# EAGLE design dual_brushed_rc (EAGLE 6.6.0)

## Sheet 1 of 8
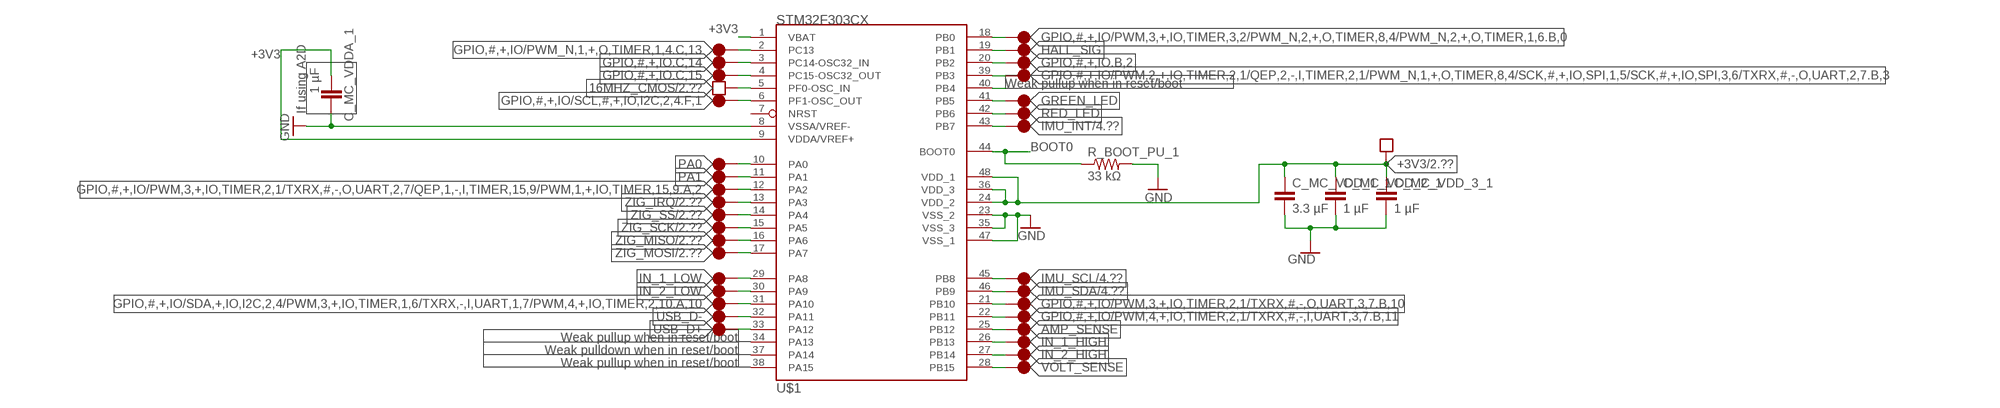
[diagram p0: schematic, sheet 1]

### Parts
C_MC_VDD_1_1  3.3 µF  C-EUC0603  [C0603]
C_MC_VDD_2_1  1 µF  C-EUC0402  [C0402]
C_MC_VDD_3_1  1 µF  C-EUC0402  [C0402]
C_MC_VDDA_1  1 µF  C-EUC0402  [C0402]
R_BOOT_PU_1  33 kΩ  R-US_R0402  [R0402]
U$1  STM32F303CX  [LQFP48]

### Nets
16MHZ_CMOS: U$1.5(PF0-OSC_IN) ; supply symbol labelled BLOCK_REQUIREMENT ; also sheet 2,3
+3V3: C_MC_VDD_1_1.1 C_MC_VDD_2_1.1 C_MC_VDD_3_1.1 C_MC_VDDA_1.1 U$1.1(VBAT) U$1.9(VDDA/VREF+) U$1.24(VDD_2) U$1.36(VDD_3) U$1.48(VDD_1) ; supply symbol labelled BLOCK_REQUIREMENT ; also sheet 2,3,4,5,6
AMP_SENSE: U$1.25(PB12) ; supply symbol labelled BLOCK_CONNECTOR ; also sheet 5
BLUE_LED: U$1.40(PB4) ; also sheet 8
BOOT0: R_BOOT_PU_1.1 U$1.44(BOOT0) ; also sheet 7
GND: C_MC_VDD_1_1.2 C_MC_VDD_2_1.2 C_MC_VDD_3_1.2 C_MC_VDDA_1.2 R_BOOT_PU_1.2 U$1.8(VSSA/VREF-) U$1.23(VSS_2) U$1.35(VSS_3) U$1.47(VSS_1) ; also sheet 2,3,4,5,6,7,8
GPIO,#,+,IO.B,2: U$1.20(PB2) ; supply symbol labelled BLOCK_CONNECTOR
GPIO,#,+,IO.C,14: U$1.3(PC14-OSC32_IN) ; supply symbol labelled BLOCK_CONNECTOR
GPIO,#,+,IO.C,15: U$1.4(PC15-OSC32_OUT) ; supply symbol labelled BLOCK_CONNECTOR
GPIO,#,+,IO/PWM,2,+,IO,TIMER,2,1/QEP,2,-,I,TIMER,2,1/PWM_N,1,+,O,TIMER,8,4/SCK,#,+,IO,SPI,1,5/SCK,#,+,IO,SPI,3,6/TXRX,#,-,O,UART,2,7.B,3: U$1.39(PB3) ; supply symbol labelled BLOCK_CONNECTOR
GPIO,#,+,IO/PWM,3,+,IO,TIMER,2,1/TXRX,#,-,O,UART,2,7/QEP,1,-,I,TIMER,15,9/PWM,1,+,IO,TIMER,15,9.A,2: U$1.12(PA2) ; supply symbol labelled BLOCK_CONNECTOR
GPIO,#,+,IO/PWM,3,+,IO,TIMER,2,1/TXRX,#,-,O,UART,3,7.B,10: U$1.21(PB10) ; supply symbol labelled BLOCK_CONNECTOR
GPIO,#,+,IO/PWM,3,+,IO,TIMER,3,2/PWM_N,2,+,O,TIMER,8,4/PWM_N,2,+,O,TIMER,1,6.B,0: U$1.18(PB0) ; supply symbol labelled BLOCK_CONNECTOR
GPIO,#,+,IO/PWM,4,+,IO,TIMER,2,1/TXRX,#,-,I,UART,3,7.B,11: U$1.22(PB11) ; supply symbol labelled BLOCK_CONNECTOR
GPIO,#,+,IO/PWM_N,1,+,O,TIMER,1,4.C,13: U$1.2(PC13) ; supply symbol labelled BLOCK_CONNECTOR
GPIO,#,+,IO/SCL,#,+,IO,I2C,2,4.F,1: U$1.6(PF1-OSC_OUT) ; supply symbol labelled BLOCK_CONNECTOR
GPIO,#,+,IO/SDA,+,IO,I2C,2,4/PWM,3,+,IO,TIMER,1,6/TXRX,-,I,UART,1,7/PWM,4,+,IO,TIMER,2,10.A,10: U$1.31(PA10) ; supply symbol labelled BLOCK_CONNECTOR
GREEN_LED: U$1.41(PB5) ; supply symbol labelled BLOCK_CONNECTOR ; also sheet 8
HALL_SIG: U$1.19(PB1) ; supply symbol labelled BLOCK_CONNECTOR ; also sheet 6
IMU_INT: U$1.43(PB7) ; supply symbol labelled BLOCK_CONNECTOR ; also sheet 4
IMU_SCL: U$1.45(PB8) ; supply symbol labelled BLOCK_CONNECTOR ; also sheet 4
IMU_SDA: U$1.46(PB9) ; supply symbol labelled BLOCK_CONNECTOR ; also sheet 4
IN_1_HIGH: U$1.26(PB13) ; supply symbol labelled BLOCK_CONNECTOR ; also sheet 5
IN_1_LOW: U$1.29(PA8) ; supply symbol labelled BLOCK_CONNECTOR ; also sheet 5
IN_2_HIGH: U$1.27(PB14) ; supply symbol labelled BLOCK_CONNECTOR ; also sheet 5
IN_2_LOW: U$1.30(PA9) ; supply symbol labelled BLOCK_CONNECTOR ; also sheet 5
PA0: U$1.10(PA0) ; supply symbol labelled BLOCK_CONNECTOR
PA1: U$1.11(PA1) ; supply symbol labelled BLOCK_CONNECTOR
RED_LED: U$1.42(PB6) ; supply symbol labelled BLOCK_CONNECTOR ; also sheet 8
USB_D+: U$1.33(PA12) ; supply symbol labelled BLOCK_CONNECTOR ; also sheet 7
USB_D-: U$1.32(PA11) ; supply symbol labelled BLOCK_CONNECTOR ; also sheet 7
VOLT_SENSE: U$1.28(PB15) ; supply symbol labelled BLOCK_CONNECTOR ; also sheet 6
ZIG_IRQ: U$1.13(PA3) ; supply symbol labelled BLOCK_CONNECTOR ; also sheet 2
ZIG_MISO: U$1.16(PA6) ; supply symbol labelled BLOCK_CONNECTOR ; also sheet 2
ZIG_MOSI: U$1.17(PA7) ; supply symbol labelled BLOCK_CONNECTOR ; also sheet 2
ZIG_SCK: U$1.15(PA5) ; supply symbol labelled BLOCK_CONNECTOR ; also sheet 2
ZIG_SS: U$1.14(PA4) ; supply symbol labelled BLOCK_CONNECTOR ; also sheet 2
Unconnected: U$1.7(NRST) U$1.34(PA13) U$1.37(PA14) U$1.38(PA15)

### Notes on the sheet
- Weak pullup when in reset/boot
- If using A2D
- Weak pullup when in reset/boot
- Weak pulldown when in reset/boot
- Weak pullup when in reset/boot

## Sheet 2 of 8
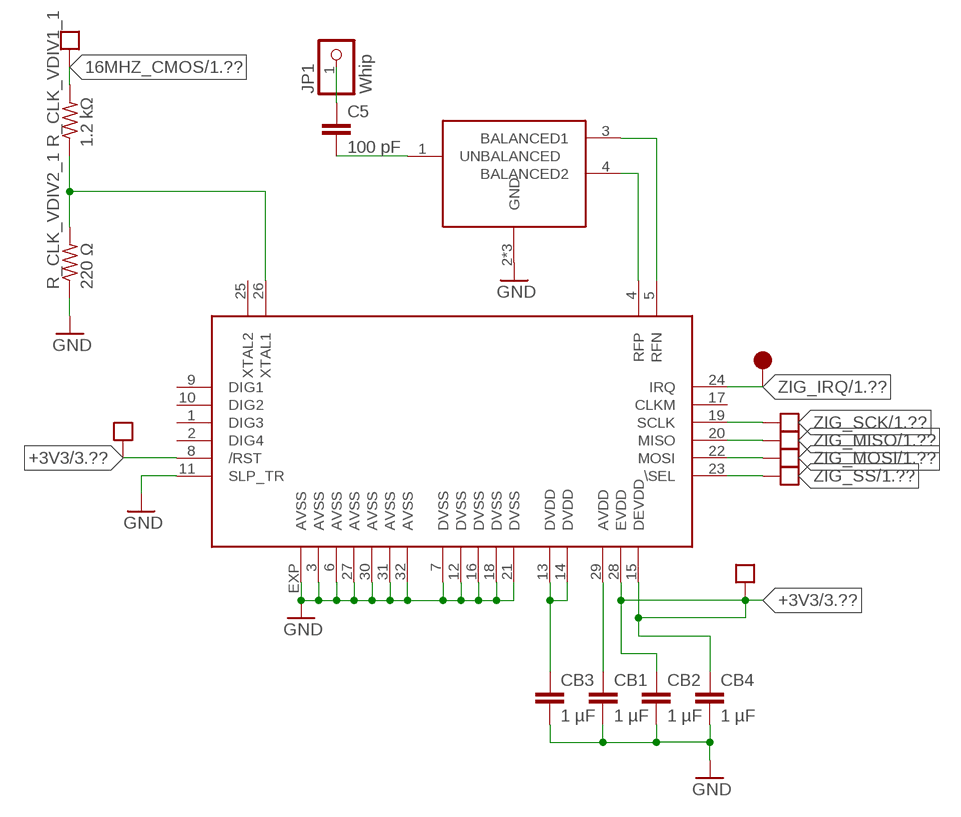
[diagram p1: schematic, sheet 2]

### Parts
BALUN1  0896FB15A0100  [0896FB15A0100]
C5  100 pF  C-EUC0402  [C0402]
CB1  1 µF  C-EUC0402  [C0402]
CB2  1 µF  C-EUC0402  [C0402]
CB3  1 µF  C-EUC0402  [C0402]
CB4  1 µF  C-EUC0402  [C0402]
JP1  Whip  PINHD-1X01_2.54-S  [1X01-S]
R_CLK_VDIV1_1  1.2 kΩ  R-US_R0402  [R0402]
R_CLK_VDIV2_1  220 Ω  R-US_R0402  [R0402]
U$51  AT86RF  [QFNN32]

### Nets
16MHZ_0V5_1: R_CLK_VDIV1_1.1 R_CLK_VDIV2_1.2 U$51.26(XTAL1)
16MHZ_CMOS: R_CLK_VDIV1_1.2 ; supply symbol labelled BLOCK_REQUIREMENT ; also sheet 1,3
+3V3: CB2.1 CB4.1 U$51.8(/RST) U$51.15(DEVDD) U$51.28(EVDD) ; supply symbol labelled BLOCK_REQUIREMENT ; also sheet 1,3,4,5,6
GND: BALUN1.2(GND) BALUN1.5(GND) BALUN1.6(GND) CB1.2 CB2.2 CB3.2 CB4.2 R_CLK_VDIV2_1.1 U$51.3(AVSS) U$51.6(AVSS) U$51.7(DVSS) U$51.11(SLP_TR) U$51.12(DVSS) U$51.16(DVSS) U$51.18(DVSS) U$51.21(DVSS) U$51.27(AVSS) U$51.30(AVSS) U$51.31(AVSS) U$51.32(AVSS) U$51.EXP(AVSS) ; also sheet 1,3,4,5,6,7,8
N$2: BALUN1.1(UNBALANCED) C5.2
N$3: C5.1 JP1.1
N$4: CB3.1 U$51.13(DVDD) U$51.14(DVDD)
N$6: CB1.1 U$51.29(AVDD)
N$8: BALUN1.4(BALANCED2) U$51.4(RFP)
N$9: BALUN1.3(BALANCED1) U$51.5(RFN)
ZIG_IRQ: U$51.24(IRQ) ; supply symbol labelled BLOCK_CONNECTOR ; also sheet 1
ZIG_MISO: U$51.20(MISO) ; supply symbol labelled BLOCK_REQUIREMENT ; also sheet 1
ZIG_MOSI: U$51.22(MOSI) ; supply symbol labelled BLOCK_REQUIREMENT ; also sheet 1
ZIG_SCK: U$51.19(SCLK) ; supply symbol labelled BLOCK_REQUIREMENT ; also sheet 1
ZIG_SS: U$51.23(\SEL) ; supply symbol labelled BLOCK_REQUIREMENT ; also sheet 1
Unconnected: U$51.1(DIG3) U$51.2(DIG4) U$51.9(DIG1) U$51.10(DIG2) U$51.17(CLKM) U$51.25(XTAL2)

## Sheet 3 of 8
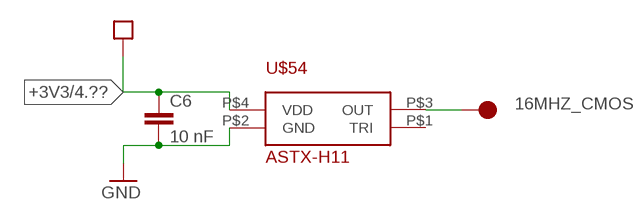
[diagram p2: schematic, sheet 3]

### Parts
C6  10 nF  C-EUC0402  [C0402]
U$54  ASTX-H11  [ASTX-H11]

### Nets
16MHZ_CMOS: U$54.P$3(OUT) ; supply symbol labelled BLOCK_CONNECTOR ; also sheet 1,2
+3V3: C6.1 U$54.P$4(VDD) ; supply symbol labelled BLOCK_REQUIREMENT ; also sheet 1,2,4,5,6
GND: C6.2 U$54.P$2(GND) ; also sheet 1,2,4,5,6,7,8
Unconnected: U$54.P$1(TRI)

## Sheet 4 of 8: IMU
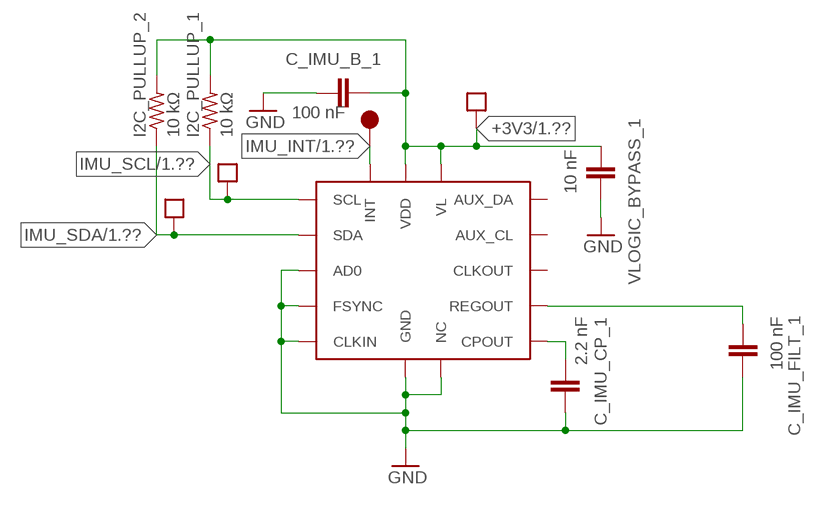
[diagram p3: schematic, sheet 4]

### Parts
C_IMU_B_1  100 nF  C-EUC0402  [C0402]
C_IMU_CP_1  2.2 nF  C-EUC0402  [C0402]
C_IMU_FILT_1  100 nF  C-EUC0402  [C0402]
I2C_PULLUP_1  10 kΩ  R-US_R0402  [R0402]
I2C_PULLUP_2  10 kΩ  R-US_R0402  [R0402]
U$46  MPU-6050  [QFN24]
VLOGIC_BYPASS_1  10 nF  C-EUC0402  [C0402]

### Nets
+3V3: C_IMU_B_1.1 I2C_PULLUP_1.2 I2C_PULLUP_2.2 U$46.P$8(VL) U$46.P$13(VDD) VLOGIC_BYPASS_1.1 ; supply symbol labelled BLOCK_REQUIREMENT ; also sheet 1,2,3,5,6
GND: C_IMU_B_1.2 C_IMU_CP_1.2 C_IMU_FILT_1.2 U$46.P$1(CLKIN) U$46.P$2(NC) U$46.P$3(NC) U$46.P$4(NC) U$46.P$5(NC) U$46.P$9(AD0) U$46.P$11(FSYNC) U$46.P$14(NC) U$46.P$15(NC) U$46.P$16(NC) U$46.P$17(NC) U$46.P$18(GND) U$46.P$25(GND) VLOGIC_BYPASS_1.2 ; also sheet 1,2,3,5,6,7,8
IMU_INT: U$46.P$12(INT) ; supply symbol labelled BLOCK_CONNECTOR ; also sheet 1
IMU_SCL: I2C_PULLUP_1.1 U$46.P$23(SCL) ; supply symbol labelled BLOCK_REQUIREMENT ; also sheet 1
IMU_SDA: I2C_PULLUP_2.1 U$46.P$24(SDA) ; supply symbol labelled BLOCK_REQUIREMENT ; also sheet 1
N$5: C_IMU_CP_1.1 U$46.P$20(CPOUT)
REGOUT_1: C_IMU_FILT_1.1 U$46.P$10(REGOUT)
Unconnected: U$46.P$6(AUX_DA) U$46.P$7(AUX_CL) U$46.P$22(CLKOUT)

## Sheet 5 of 8
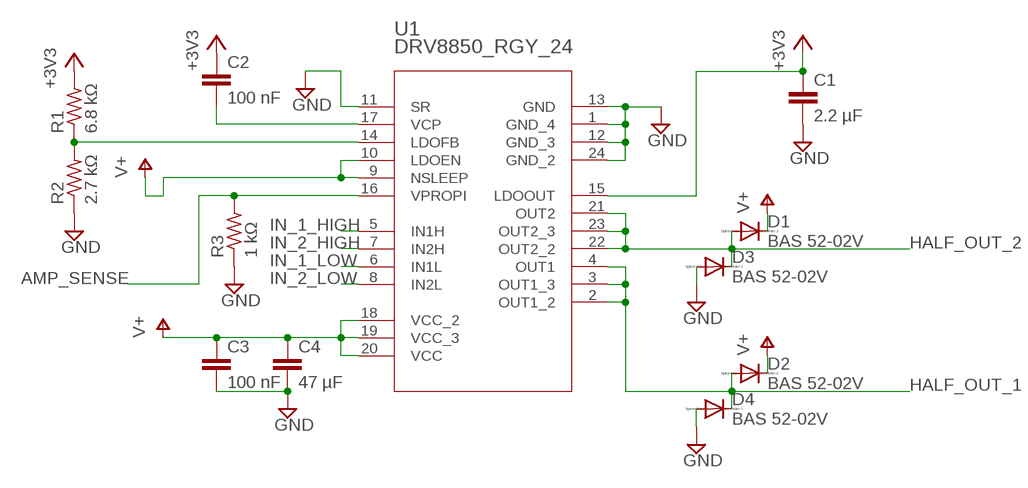
[diagram p4: schematic, sheet 5]

### Parts
C1  2.2 µF  C-EUC0603  [C0603]
C2  100 nF  C-EUC0402  [C0402]
C3  100 nF  C-EUC0402  [C0402]
C4  47 µF  C-EUC0805  [C0805]
D1  BAS 52-02V  DIODE-SOD523  [SOD523]
D2  BAS 52-02V  DIODE-SOD523  [SOD523]
D3  BAS 52-02V  DIODE-SOD523  [SOD523]
D4  BAS 52-02V  DIODE-SOD523  [SOD523]
R1  6.8 kΩ  R-US_R0402  [R0402]
R2  2.7 kΩ  R-US_R0402  [R0402]
R3  1 kΩ  R-US_R0402  [R0402]
U1  DRV8850_RGY_24  [RGY_24]

### Nets
+3V3: C1.1 C2.1 R1.2 U1.15(LDOOUT) ; also sheet 1,2,3,4,6
AMP_SENSE: R3.2 U1.16(VPROPI) ; also sheet 1
GND: C1.2 C3.2 C4.2 D3.A D4.A R2.1 R3.1 U1.1(GND_4) U1.11(SR) U1.12(GND_3) U1.13(GND) U1.24(GND_2) ; also sheet 1,2,3,4,6,7,8
HALF_OUT_1: D2.A D4.C U1.2(OUT1_2) U1.3(OUT1_3) U1.4(OUT1) ; also sheet 6
HALF_OUT_2: D1.A D3.C U1.21(OUT2) U1.22(OUT2_2) U1.23(OUT2_3) ; also sheet 6
IN_1_HIGH: U1.5(IN1H) ; also sheet 1
IN_1_LOW: U1.6(IN1L) ; also sheet 1
IN_2_HIGH: U1.7(IN2H) ; also sheet 1
IN_2_LOW: U1.8(IN2L) ; also sheet 1
N$1: R1.1 R2.2 U1.14(LDOFB)
N$7: C2.2 U1.17(VCP)
V+: C3.1 C4.1 D1.C D2.C U1.9(NSLEEP) U1.10(LDOEN) U1.18(VCC_2) U1.19(VCC_3) U1.20(VCC) ; also sheet 6,7

## Sheet 6 of 8
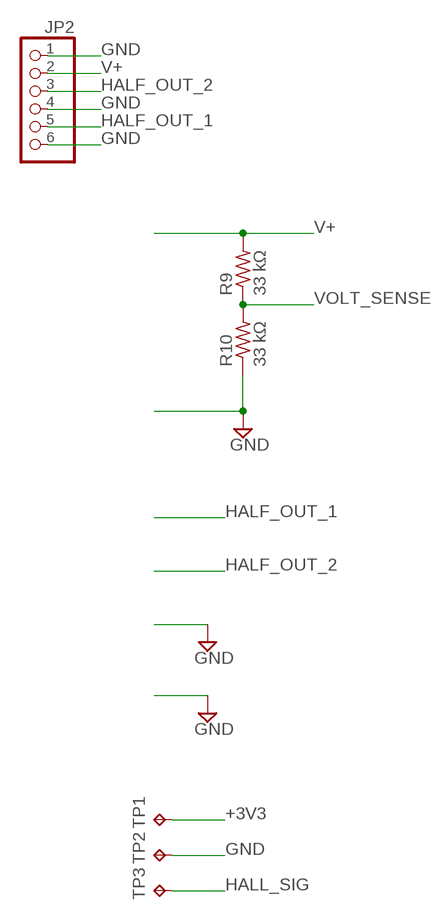
[diagram p5: schematic, sheet 6]

### Parts
JP2  PINHD-1X06_2.00  [1X06M]
R9  33 kΩ  R-US_R0402  [R0402]
R10  33 kΩ  R-US_R0402  [R0402]
TP1  TPTP10SQ  [TP10SQ]
TP2  TPTP10SQ  [TP10SQ]
TP3  TPTP10SQ  [TP10SQ]

### Nets
+3V3: TP1.TP ; also sheet 1,2,3,4,5
GND: JP2.1 JP2.4 JP2.6 R10.1 TP2.TP ; also sheet 1,2,3,4,5,7,8
HALF_OUT_1: JP2.5 ; also sheet 5
HALF_OUT_2: JP2.3 ; also sheet 5
HALL_SIG: TP3.TP ; also sheet 1
V+: JP2.2 R9.2 ; also sheet 5,7
VOLT_SENSE: R9.1 R10.2 ; also sheet 1

## Sheet 7 of 8
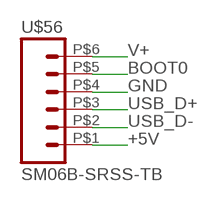
[diagram p6: schematic, sheet 7]

### Parts
U$56  SM06B-SRSS-TB  [SM06B-SRSS-TB]

### Nets
+5V: U$56.P$1
BOOT0: U$56.P$5 ; also sheet 1
GND: U$56.P$4 ; also sheet 1,2,3,4,5,6,8
USB_D+: U$56.P$3 ; also sheet 1
USB_D-: U$56.P$2 ; also sheet 1
V+: U$56.P$6 ; also sheet 5,6

## Sheet 8 of 8
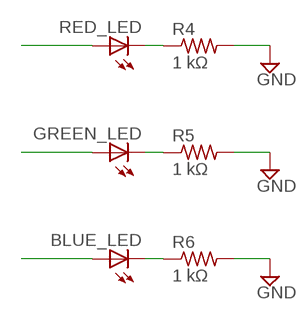
[diagram p7: schematic, sheet 8]

### Parts
BLUE_LED  LEDCHIPLED_0603  [CHIPLED_0603]
GREEN_LED  LEDCHIPLED_0603  [CHIPLED_0603]
R4  1 kΩ  R-US_R0402  [R0402]
R5  1 kΩ  R-US_R0402  [R0402]
R6  1 kΩ  R-US_R0402  [R0402]
RED_LED  LEDCHIPLED_0603  [CHIPLED_0603]

### Nets
BLUE_LED: BLUE_LED.A ; also sheet 1
GND: R4.2 R5.2 R6.2 ; also sheet 1,2,3,4,5,6,7
GREEN_LED: GREEN_LED.A ; also sheet 1
N$10: R4.1 RED_LED.C
N$12: GREEN_LED.C R5.1
N$14: BLUE_LED.C R6.1
RED_LED: RED_LED.A ; also sheet 1

## Library data of the parts
BALUN1 = piccoli:0896FB15A0100
BLUE_LED GREEN_LED RED_LED = led:LED: LED OSRAM: - CHIPLED LG R971, LG N971, LY N971, LG Q971, LY Q971, LO R971, LY R971 LH N974, LH R974 LS Q976, LO Q976, LY Q976 LO Q996 - Hyper CHIPLED LW Q18S LB Q993, LB Q99A, LB R99A - SideLED LS A670, LO A670, LY A670, LG A670, LP A670 LB A673, LV A673, LT A673, LW A673 LH A674 LY A675 LS A676, LA A676, LO A676, LY A676, LW A676 LS A679, LY A679, LG A679 - Hyper Micro SIDELED® LS Y876, LA Y876, LO Y876, LY Y876 LT Y87S - SmartLED LW L88C, LW L88S LB L89C, LB L89S, LG L890 LS L89K, LO L89K, LY L89K LS L896, LA L896, LO L896, LY L896 - TOPLED LS T670, LO T670, LY T670, LG T670, LP T670 LSG T670, LSP T670, LSY T670, LOP T670, LYG T670 LG T671, LOG T671, LSG T671 LB T673, LV T673, LT T673, LW T673 LH T674 LS T676, LA T676, LO T676, LY T676, LB T676, LH T676, LSB T676, LW T676 LB T67C, LV T67C, LT T67C, LS T67K, LO T67K, LY T67K, LW E67C LS E67B, LA E67B, LO E67B, LY E67B, LB E67C, LV E67C, LT E67C LW T67C LS T679, LY T679, LG T679 LS T770, LO T770, LY T770, LG T770, LP T770 LB T773, LV T773, LT T773, LW T773 LH T774 LS E675, LA E675, LY E675, LS T675 LS T776, LA T776, LO T776, LY T776, LB T776 LHGB T686 LT T68C, LB T68C - Hyper Mini TOPLED® LB M676 - Mini TOPLED Santana® LG M470 LS M47K, LO M47K, LY M47K Source: http://www.osram.convergy.de LUXEON: - LUMILED® LXK2-PW12-R00, LXK2-PW12-S00, LXK2-PW14-U00, LXK2-PW14-V00 LXK2-PM12-R00, LXK2-PM12-S00, LXK2-PM14-U00 LXK2-PE12-Q00, LXK2-PE12-R00, LXK2-PE12-S00, LXK2-PE14-T00, LXK2-PE14-U00 LXK2-PB12-K00, LXK2-PB12-L00, LXK2-PB12-M00, LXK2-PB14-N00, LXK2-PB14-P00, LXK2-PB14-Q00 LXK2-PR12-L00, LXK2-PR12-M00, LXK2-PR14-Q00, LXK2-PR14-R00 LXK2-PD12-Q00, LXK2-PD12-R00, LXK2-PD12-S00 LXK2-PH12-R00, LXK2-PH12-S00 LXK2-PL12-P00, LXK2-PL12-Q00, LXK2-PL12-R00 Source: www.luxeon.com KINGBRIGHT: KA-3528ASYC Source: www.kingbright.com
C1-C6 C_IMU_B_1 C_IMU_CP_1 C_IMU_FILT_1 C_MC_VDD_1_1 C_MC_VDD_2_1 C_MC_VDD_3_1 C_MC_VDDA_1 CB1-CB4 VLOGIC_BYPASS_1 = rcl:C-EU: CAPACITOR, European symbol
D1-D4 = diode:DIODE-: DIODE
I2C_PULLUP_1 I2C_PULLUP_2 R_BOOT_PU_1 R_CLK_VDIV1_1 R_CLK_VDIV2_1 = resistor:R-US_: RESISTOR, American symbol
JP1 = pinhead-2:PINHD-1X01: PIN HEADER
JP2 = pinhead-2:PINHD-1X06: PIN HEADER
R1-R6 R9 R10 = rcl:R-US_: RESISTOR, American symbol
TP1-TP3 = testpad:TP: Test pad
U1 = block_parts:DRV8850_RGY_24: The DRV8850 from Texas Instruments is a Low-Voltage H-bridge IC With LDO Voltage Regulation.; MANUFACTURER_PART_NUMBER: drv8850_rgy_24; VENDOR: Texas Instruments
U$1 = piccoli:STM32F303CX
U$46 = zz-upenn 2:MPU-6050
U$51 = piccoli:AT86RF
U$54 = block_parts:ASTX-H11
U$56 = block_parts:SM06B-SRSS-TB

## Board
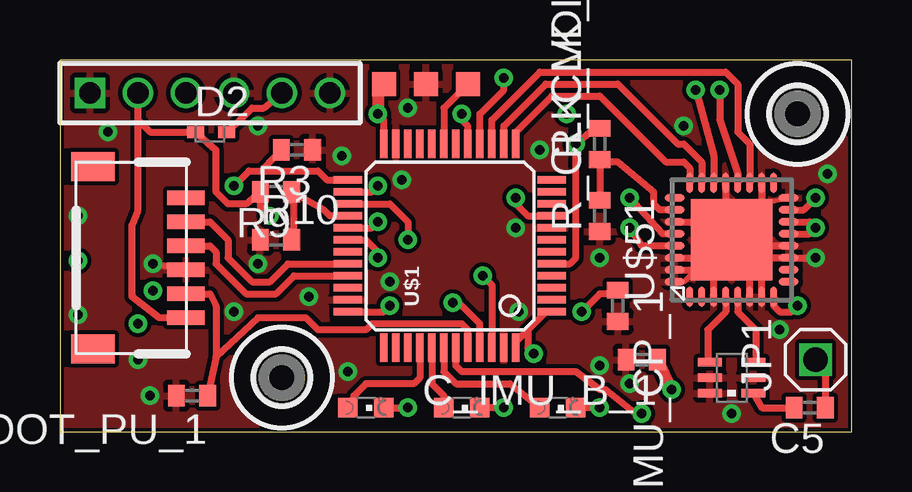
[diagram p8: board, top side]
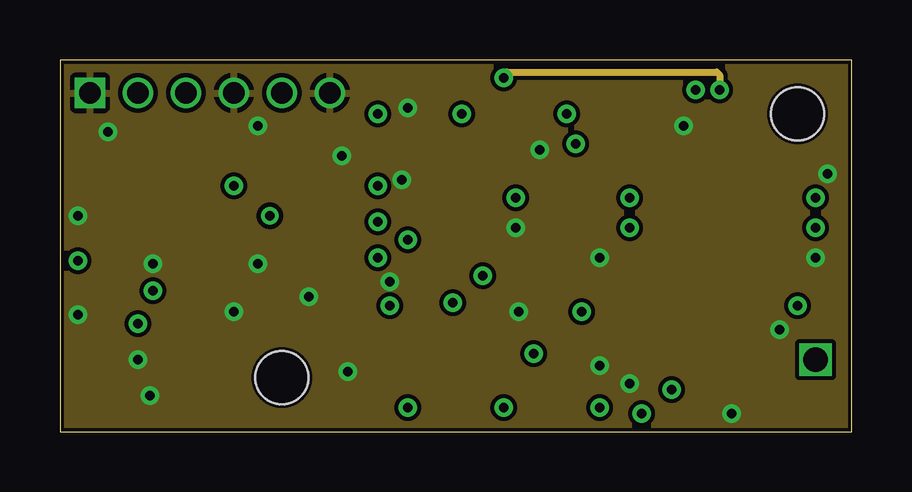
[diagram p9: board, inner layer Route2]
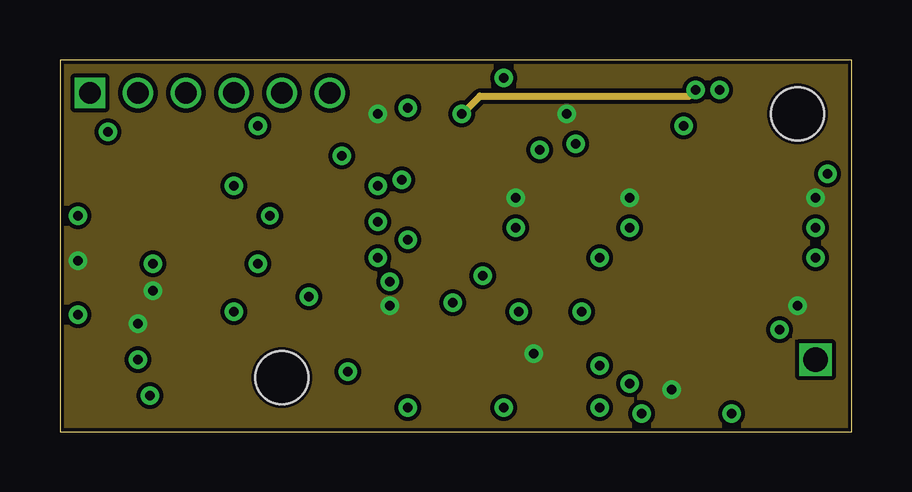
[diagram p10: board, inner layer Route15]
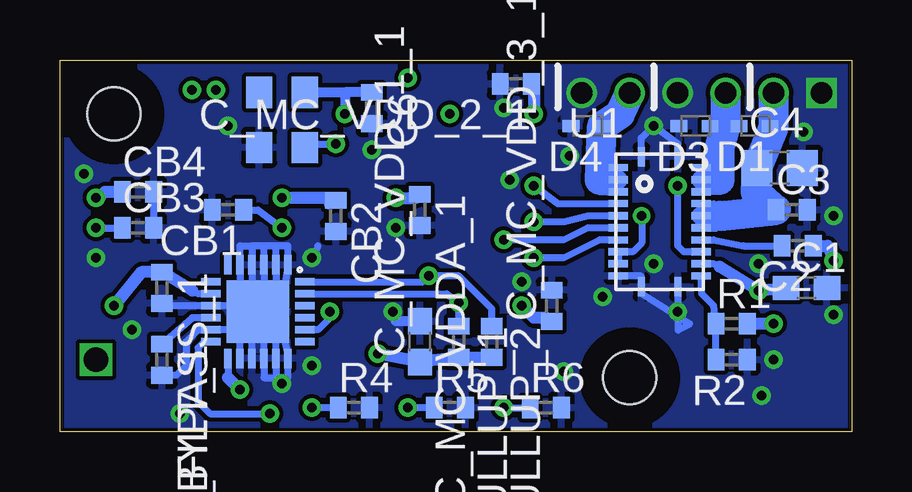
[diagram p11: board, bottom side, seen from below]

Size 33 x 15.5 mm. Coordinates in mm from the lower left corner, seen from the top.
Outline: 0,0 33,0 33,15.5 0,15.5 0,0
Copper layers (1*2+15*16): Top 0.0356mm / dielectric 1.5011mm / Route2 0.0356mm / dielectric 0.1499mm / Route15 0.0356mm / dielectric 0.2007mm / Bottom 0.0356mm
Design rules "LaenPCBOrder *": minimum track width 6mil, minimum drill 13mil, track to track 7mil, track to pad 7mil, pad to pad 7mil, via to via 7mil, smd to smd 6mil, copper to edge 6mil, drill to drill 6mil, minimum pad ring 7mil, minimum via ring 7mil, stop-mask expansion 4mil, vias tented up to drill 0mil, thermal gap 8mil
tRestrict: area 27.5,3.2 to 28.5,4.5

### Footprints (pad centres in the part's own frame; a part is rotated, then mirrored left to right if it is on the bottom)
0896FB15A0100 = smd 0.35 x 1: 1 -0.65,-0.9; 2 0,-0.9; 3 0.65,-0.9; 4 0.65,0.9; 5 0,0.9; 6 -0.65,0.9
CHIPLED_0603 = smd 0.8 x 0.8: A 0,-0.75; C 0,0.75
C0603 = smd 1.1 x 1: 1 -0.85,0; 2 0.85,0
C0402 = smd 0.7 x 0.9: 1 -0.65,0; 2 0.65,0
C0805 = smd 1.3 x 1.5: 1 -0.95,0; 2 0.95,0
SOD523 = smd 0.7 x 0.5: A 0.7,0; C -0.6,0
R0402 = smd 0.7 x 0.9: 1 -0.65,0; 2 0.65,0
1X01-S = drill 1.016 square: 1 0,0
1X06M = drill 0.914 square: 1 -5,0 | drill 0.914: 2 -3,0; 3 -1,0; 4 1,0; 5 3,0; 6 5,0
TP10SQ = smd 1 x 1: TP 0,0
RGY_24 = smd 0.305 x 0.813: 1 -0.762,2.718; 12 -0.762,-2.718; 13 0.762,-2.718; 24 0.762,2.718 | smd 0.813 x 0.305: 2 -1.727,2.261; 3 -1.727,1.753; 4 -1.727,1.245; 5 -1.727,0.762; 6 -1.727,0.254; 7 -1.727,-0.254; 8 -1.727,-0.762; 9 -1.727,-1.245; 10 -1.727,-1.753; 11 -1.727,-2.261; 14 1.727,-2.261; 15 1.727,-1.753; 16 1.727,-1.245; 17 1.727,-0.762; 18 1.727,-0.254; 19 1.727,0.254; 20 1.727,0.762; 21 1.727,1.245; 22 1.727,1.753; 23 1.727,2.261
LQFP48 = smd 0.3 x 1.2: 1 -2.75,-4.25; 2 -2.25,-4.25; 3 -1.75,-4.25; 4 -1.25,-4.25; 5 -0.75,-4.25; 6 -0.25,-4.25; 7 0.25,-4.25; 8 0.75,-4.25; 9 1.25,-4.25; 10 1.75,-4.25; 11 2.25,-4.25; 12 2.75,-4.25; 25 2.75,4.25; 26 2.25,4.25; 27 1.75,4.25; 28 1.25,4.25; 29 0.75,4.25; 30 0.25,4.25; 31 -0.25,4.25; 32 -0.75,4.25; 33 -1.25,4.25; 34 -1.75,4.25; 35 -2.25,4.25; 36 -2.75,4.25 | smd 1.2 x 0.3: 13 4.25,-2.75; 14 4.25,-2.25; 15 4.25,-1.75; 16 4.25,-1.25; 17 4.25,-0.75; 18 4.25,-0.25; 19 4.25,0.25; 20 4.25,0.75; 21 4.25,1.25; 22 4.25,1.75; 23 4.25,2.25; 24 4.25,2.75; 37 -4.25,2.75; 38 -4.25,2.25; 39 -4.25,1.75; 40 -4.25,1.25; 41 -4.25,0.75; 42 -4.25,0.25; 43 -4.25,-0.25; 44 -4.25,-0.75; 45 -4.25,-1.25; 46 -4.25,-1.75; 47 -4.25,-2.25; 48 -4.25,-2.75
QFN24 = smd 0.3 x 0.8: P$1 -1.25,-1.955; P$2 -0.75,-1.955; P$3 -0.25,-1.955; P$4 0.25,-1.955; P$5 0.75,-1.955; P$6 1.25,-1.955; P$13 1.25,1.955; P$14 0.75,1.955; P$15 0.25,1.955; P$16 -0.25,1.955; P$17 -0.75,1.955; P$18 -1.25,1.955 | smd 0.8 x 0.3: P$7 1.955,-1.25; P$8 1.955,-0.75; P$9 1.955,-0.25; P$10 1.955,0.25; P$11 1.955,0.75; P$12 1.955,1.25; P$19 -1.955,1.25; P$20 -1.955,0.75; P$21 -1.955,0.25; P$22 -1.955,-0.25; P$23 -1.955,-0.75; P$24 -1.955,-1.25 | smd 2.6 x 2.6: P$25 0,0
QFNN32 = smd 0.85 x 0.3: 1 -2.375,1.75; 2 -2.375,1.25; 3 -2.375,0.75; 4 -2.375,0.25; 5 -2.375,-0.25; 6 -2.375,-0.75; 7 -2.375,-1.25; 8 -2.375,-1.75; 17 2.375,-1.75; 18 2.375,-1.25; 19 2.375,-0.75; 20 2.375,-0.25; 21 2.375,0.25; 22 2.375,0.75; 23 2.375,1.25; 24 2.375,1.75 | smd 0.3 x 0.85: 9 -1.75,-2.375; 10 -1.25,-2.375; 11 -0.75,-2.375; 12 -0.25,-2.375; 13 0.25,-2.375; 14 0.75,-2.375; 15 1.25,-2.375; 16 1.75,-2.375; 25 1.75,2.375; 26 1.25,2.375; 27 0.75,2.375; 28 0.25,2.375; 29 -0.25,2.375; 30 -0.75,2.375; 31 -1.25,2.375; 32 -1.75,2.375 | smd 3.4 x 3.4: EXP 0,0
M2_HOLE_PLASTIC = hole 2.2: 0,0
ASTX-H11 = smd 1.3 x 1.1: P$1 -1.15,-0.95; P$2 1.15,-0.95; P$3 1.15,0.95; P$4 -1.15,0.95
SM06B-SRSS-TB = smd 0.6 x 1.55: P$1 -2.5,0; P$2 -1.5,0; P$3 -0.5,0; P$4 0.5,0; P$5 1.5,0; P$6 2.5,0 | smd 1.2 x 1.8: P$7 3.8,-3.875; P$8 -3.8,-3.875

### Placement (x,y rotation side)
BALUN1  28,2.25 90 top
BLUE_LED  12.75,1 270 top
C1  1.88,6 0 bottom
C2  2.25,7.75 180 bottom
C3  2.5,9.25 0 bottom
C4  3,11 0 bottom
C5  31.25,1 180 top
C6  20,13.5 270 bottom
C_IMU_B_1  24.25,3 180 top
C_IMU_CP_1  23.25,5.25 270 top
C_IMU_FILT_1  28.75,3 270 bottom
C_MC_VDD_1_1  18,3.75 90 bottom
C_MC_VDD_2_1  14,14.5 180 bottom
C_MC_VDD_3_1  12.5,5.25 90 bottom
C_MC_VDDA_1  18,9.25 270 bottom
CB1  26,9.25 180 bottom
CB2  21.5,9 270 bottom
CB3  29.75,8.5 0 bottom
CB4  29.75,10 0 bottom
D1  4,12.75 180 bottom
D2  6.25,12.5 0 top
D3  6.5,12.75 180 bottom
D4  11,12.75 180 bottom
GREEN_LED  16.75,1 270 top
I2C_PULLUP_1  16.38,3.75 270 bottom
I2C_PULLUP_2  15,3.75 270 bottom
JP1  31.5,3 90 top
JP2  6.25,14.12 0 top
R1  5,4.5 0 bottom
R2  5,3 180 bottom
R3  9.88,11.75 180 top
R4  20.75,1 0 bottom
R5  16.75,1 0 bottom
R6  12.75,1 0 bottom
R9  9,10 180 top
R10  9,8 0 top
R_BOOT_PU_1  5.5,1.5 180 top
R_CLK_VDIV1_1  22.5,12 90 top
R_CLK_VDIV2_1  22.5,9 90 top
RED_LED  20.75,1 270 top
TP1  13.5,14.5 0 top
TP2  15.25,14.5 0 top
TP3  17,14.5 0 top
U1  8,8.75 0 bottom
U$1  16.25,7.75 90 top
U$46  24.75,5 180 bottom
U$51  28,8 90 top
U$52  [M2_HOLE_PLASTIC]  30.75,13.25 0 top
U$54  23.75,13 270 bottom
U$56  5.25,7.25 270 top
U$57  [M2_HOLE_PLASTIC]  9.25,2.25 0 top
VLOGIC_BYPASS_1  28.75,6 270 bottom

### Tracks (layer width: path | path; a pad name or v marks a point on that pad's centre or on a via)
16MHZ_0V5_1
  Top 0.3: U$51.26 25,9.25 24.75,9.5 24.75,10 23.25,11.25 22.5,11.25 | 22.5,11.25 R_CLK_VDIV2_1.2 | 22.5,11.25 R_CLK_VDIV1_1.1
16MHZ_CMOS  (via drill 0.4)
  Top 0.3: U$1.5 21.25,7 21.5,7.25 v21.5,12 22.1,12.5 R_CLK_VDIV1_1.2
  Bottom 0.3: U$54.P$3 22.55,12 v21.5,12
+3V3  (via drill 0.4)
  Top 0.3: U$51.15 31,9.25 v31.5,9.75 | U$51.8 29.75,5.25 30,5 30.5,5 v30.75,5.25 | v19,9.75 19,9.5 19.5,9 U$1.9 | 12.25,5 U$1.36 13.5,5 v13.75,5.25 | U$1.1 20.25,5 19.5,4.25 | U$51.28 25.12,8.25 v23.75,9.75 | U$1.24 13.5,13 v13.25,13.25 | 19.5,4.25 19.5,3.5 v19.75,3.25 | U$1.48 19,3.75 19.5,4.25
  Top 0.406: TP1.TP 13.25,14.25
  Top 0.5: v25.5,1.75 C_IMU_B_1.1 | 13.25,14.25 v13.25,13.25
  Bottom 0.3: U$46.P$8 27.25,5.75 27.48,5.88 | U$46.P$13 26,2.25 | 12.75,4.75 C_MC_VDD_3_1.1 | 5.5,6.88 5.75,7 U1.15
  Bottom 0.406: C6.1 21.12,14.15 | 21.12,14.15 v21.12,13.25 | U$54.P$4 21.12,14.15
  Bottom 0.5: CB4.1 31.12,10 v31.5,9.75 | I2C_PULLUP_2.2 I2C_PULLUP_1.2 C_MC_VDD_1_1.1 v19.75,3.25 | 27.48,5.88 VLOGIC_BYPASS_1.1 29.6,6.65 v30.75,5.25 | 26,2.25 v25.5,1.75 | CB2.1 21.75,9.5 21.75,9.75 v23.75,9.75 | 12.75,4.75 13.25,4.75 v13.75,5.25 | C2.1 1,7.75 v0.75,7.12 | C1.1 v3.88,5.88 5.5,6.88 | v3.25,4.5 R1.2 | C_MC_VDD_2_1.1 13.25,14.5 v13.25,13.25 | v19,9.75 18.15,9.75 C_MC_VDDA_1.1
  pour Route15: 0,15.5 33,15.5 33,0 0,0
AMP_SENSE  (via drill 0.4)
  Top 0.3: 8.62,10.88 10.75,10.88 11.12,10.5 U$1.25 | v7.25,10.25 7.88,10.88 8.62,10.88 | 8.62,10.88 8.5,11 R3.2
  Bottom 0.3: U1.16 7,7.5 7.25,7.75 v7.25,10.25
BLUE_LED
  Top 0.3: U$1.40 15,2.25 14.75,2 12.75,2 12.25,1.5 BLUE_LED.A
BOOT0
  Top 0.3: U$56.P$5 6.25,5.75 6.5,5.25 6.5,3.12 | 6.5,3.12 R_BOOT_PU_1.1 | 6.5,3.12 8.25,4.75 10.25,4.75 10.75,4.25 12.75,4.25 13,4.5 16.75,4.5 17,4.25 U$1.44
GND  (via drill 0.4)
  Top 0.2: U$51.32 26,6.25 26.5,6.75 | U$51.16 29.25,9.5
  Top 0.3: U$51.12 28.25,7.75 U$51.EXP | 28.75,7.25 U$51.11 v31.5,7.25 | U$51.6 28.75,7.25 | 28.75,7.25 U$51.EXP | U$51.7 29.25,6.75 U$51.EXP | U$51.3 27.25,7.25 | U$51.18 29.25,9.5 29.25,9.25 U$51.EXP | U$51.21 27.75,8.25 U$51.EXP | U$51.30 27.25,7.25 | 27.25,7.25 U$51.EXP | U$51.27 27.25,8.75 U$51.EXP | U$51.31 26.5,6.75 26.75,6.75 U$51.EXP | U$56.P$4 v3.88,7
  Bottom 0.3: VLOGIC_BYPASS_1.2 28.65,5.25 U$46.P$9 25,5.25 | C_IMU_FILT_1.2 28.15,2.35 27.75,2.75 27.75,3.75 27.25,4.25 U$46.P$11 24.5,4.25 U$46.P$16 | U$46.P$16 24.5,4.75 U$46.P$25 | CB4.2 CB3.2 | U1.13 7.24,4.24 6.75,4.5 8.76,5.76 U1.12 8.76,6.49 U1.11 | U1.24 7.24,12 v8.25,12.75 8.76,12.25 U1.1 | 22.25,7.75 v22.5,7.25 | U$46.P$16 24.5,2.25 24,2.25 | 24,2.25 23.5,2.25 U$46.P$18 23.5,3.25 23.75,4.25 24.75,4.75 U$46.P$25 | 24,2.25 U$46.P$17 24,4.25 U$46.P$25 | U$46.P$25 25.5,5.75 U$46.P$5 25.5,7.75 25,7.75 | U$46.P$4 25,5.25 | 25,5.25 U$46.P$25 | U$46.P$25 24.5,5.25 U$46.P$3 24.5,7.75 | U$46.P$25 24,5.75 U$46.P$2 24,7.75 | U$46.P$25 24.75,5.25 23.75,5.5 U$46.P$1 23.5,7.75 24,7.75 | 25,7.75 25,7 | 24.5,7.75 25,7.75 | 24,7.75 24.5,7.75 | U$46.P$15 25,4.75 U$46.P$25 | U$46.P$14 25.5,4.25 U$46.P$25
  Bottom 0.406: C_MC_VDD_1_1.2 19,4.6
  other vias: 19,8.5 14.5,13.5 13.75,6.25 8.25,7 22.5,2.75 14.25,10.5 12,2.5 0.75,9 2,12.5 3.75,1.5 11.75,11.5 0.75,4.88 3.25,3 19.12,5 7.25,5 23.75,2 28,0.75 30,4.25 32,10.75 10.38,5.62 20,11.75 26,12.75
  pour Bottom: 0,0 33,0 33,15.5 0,15.5
  pour Top: 0,15.5 0,0 33,0 33,15.5
  pour Route2: 0,15.5 33,15.5 33,0 0,0
  pour Bottom (no thermals): 0,15.5 12,15.5 12,13 0,13
GREEN_LED
  Top 0.3: U$1.41 15.5,2 16,1.5 GREEN_LED.A
HALF_OUT_1
  Top 0.3: D2.A 7.5,13 8,13.5 8.5,13.5 JP2.5
  Bottom 0.3: U1.4 10.13,10.47 U1.2
  Bottom 0.8: U1.3 10.13,10.47
  Bottom 1.25: JP2.5 9.65,13.25 D4.C 10.5,10.5 10.13,10.47
HALF_OUT_2
  Bottom 0.3: U1.21 5.75,10.5 U1.23 | D1.A 5.25,12.75 D3.C
  Bottom 0.8: U1.22 5.75,10.5
  Bottom 1.25: 5.75,10.5 5.5,10.5 5.5,11.88 5.25,12.75 JP2.3
HALL_SIG
  Top 0.3: TP3.TP 16,13.5 U$1.19
IMU_INT  (via drill 0.4)
  Top 0.3: v24.25,0.75 24,0.75 22.75,1.75 22.5,1.75 21.5,2.5 16.75,2.5 16.5,2.75 U$1.43
  Bottom 0.3: U$46.P$12 27,3.75 27.25,3.5 27.25,1.25 26.75,0.75 v24.25,0.75
IMU_SCL  (via drill 0.4)
  Top 0.3: U$1.45 17.5,4.5 16.75,5.25 v16.38,5.38
  Bottom 0.3: U$46.P$23 16.88,5.75 v16.38,5.38 I2C_PULLUP_1.1
IMU_SDA  (via drill 0.4)
  Top 0.3: v17.62,6.5 18,6.12 U$1.46
  Bottom 0.3: U$46.P$24 17.88,6.25 v17.62,6.5 16.38,6.5 15,5.12 I2C_PULLUP_2.1
IN_1_HIGH  (via drill 0.4)
  Top 0.3: U$1.26 13,10 v13.25,10.25
  Bottom 0.3: U1.5 12.25,9.5 v13.25,10.25
IN_1_LOW  (via drill 0.4)
  Top 0.3: U$1.29 13,8.5 v13.25,8.75
  Bottom 0.3: U1.6 11,9 12,8.75 v13.25,8.75
IN_2_HIGH  (via drill 0.4)
  Top 0.3: U$1.27 13.75,9.5 14.5,8.75 v14.5,8
  Bottom 0.3: U1.7 10.48,8.5 11,8.5 12,8 v14.5,8
IN_2_LOW  (via drill 0.4)
  Top 0.3: U$1.30 12.75,8 13.25,7.5 v13.25,7.25
  Bottom 0.3: U1.8 10.5,8 12,7.25 v13.25,7.25
N$1
  Bottom 0.3: 6.25,6.47 U1.14 6.25,5.75 5.75,5.25 R1.1 R2.2
N$2
  Top 0.3: BALUN1.1 29.25,1 C5.2
N$3
  Top 0.3: JP1.1 31.9,2.6 C5.1
N$4  (via drill 0.4)
  Top 0.3: U$51.13 31.25,8.25 v31.5,8.5 31.25,8.75 U$51.14
  Bottom 0.3: v31.5,8.5 CB3.1
N$5  (via drill 0.4)
  Top 0.3: C_IMU_CP_1.1 22.75,5.75 22.5,5.75 v21.75,5
  Bottom 0.3: v21.75,5 21.75,4.75 22.25,4.25 U$46.P$20
N$6  (via drill 0.4)
  Top 0.3: U$51.29 24.25,7.75 v23.75,8.5
  Bottom 0.3: CB1.1 24.75,9.25 v23.75,8.5
N$7
  Bottom 0.3: U1.17 5.75,8 4.5,7.75 C2.2
N$8
  Top 0.3: U$51.4 27.75,5 27,4.25 27,3 BALUN1.4
N$9
  Top 0.3: U$51.5 28.25,5 29,4.25 29,3 BALUN1.3
N$10  (via drill 0.4)
  Top 0.3: v22.5,1 RED_LED.C
  Bottom 0.3: R4.1 v22.5,1
N$12  (via drill 0.4)
  Top 0.3: v18.5,1 GREEN_LED.C
  Bottom 0.3: R5.1 v18.5,1
N$14  (via drill 0.4)
  Top 0.3: BLUE_LED.C v14.5,1
  Bottom 0.3: v14.5,1 R6.1
RED_LED
  Top 0.3: U$1.42 16,2.5 16.5,2 18.75,2 RED_LED.A
REGOUT_1
  Bottom 0.3: U$46.P$10 27.5,4.75 C_IMU_FILT_1.1
USB_D+
  Top 0.3: U$56.P$3 6.25,7.75 6.5,7.5 6.5,7 7.75,5.75 9,5.75 9.75,6.5 U$1.33
USB_D-
  Top 0.3: U$56.P$2 6.25,8.75 7,8 7,7.25 8,6.25 8.75,6.25 9.5,7 U$1.32
V+  (via drill 0.39)
  Top 0.3: U$56.P$6 4.12,4.75 3,5.62 3,8.62 3.25,9.25 3.25,13 | 3.25,13 3.75,12.5 D2.C 6.5,11.75 6.5,10 7,9.5 7.75,9.5 R9.2 8.35,9.4 v8.75,9 | 3.25,13 JP2.2
  Bottom 0.3: U1.18 5.62,8.5 5.5,9 5.75,9.5 U1.20 | D1.C JP2.2 | U1.9 9.99,7.5 | U1.10 U1.9 | v8.75,9 8.75,7.88 9.12,7.5 U1.9
  Bottom 0.8: 6.02,9 U1.19
  Bottom 1: 6.02,9 5.5,9
  Bottom 1.25: JP2.2 3.25,12.75 C4.1 4,10 C3.1 5.5,9
VOLT_SENSE
  Top 0.3: U$1.28 11.25,9 11,9.25 R9.1 9.65,9.6 9.75,9.5 9.75,8.5 9.65,8.4 R10.2
ZIG_IRQ
  Top 0.3: U$1.13 19,12.5 20.5,14 22.5,14 25.25,11.25 26,11.25 26.25,11 U$51.24
ZIG_MISO  (via drill 0.4)
  Top 0.3: U$1.16 17.5,13.25 18.5,14.25 v18.5,14.75 | v27.5,14.25 27.5,13 28.25,10.75 U$51.20
  Route2 0.3: v18.5,14.75 18.5,14.88 18.62,15 27.38,15 27.5,14.88 v27.5,14.25
ZIG_MOSI  (via drill 0.4)
  Top 0.3: U$1.17 17,12.75 16.88,12.88 v16.75,13.25 | v26.5,14.25 27.25,11.5 U$51.22
  Route15 0.3: v16.75,13.25 17.5,14 26.25,14 v26.5,14.25
ZIG_SCK
  Top 0.3: U$1.15 18,13 20,15 27.75,15 28.25,14.5 28.25,12.5 28.75,12 U$51.19
ZIG_SS
  Top 0.3: U$1.14 18.5,12.75 20.25,14.5 23.25,14.5 25.75,12 26,12 26.75,11.25 U$51.23

### Text on the board
tValues: - | + | JST SH | BALUN
tDocu: DC | Coax
bDocu: Paulos | 5A | 5V